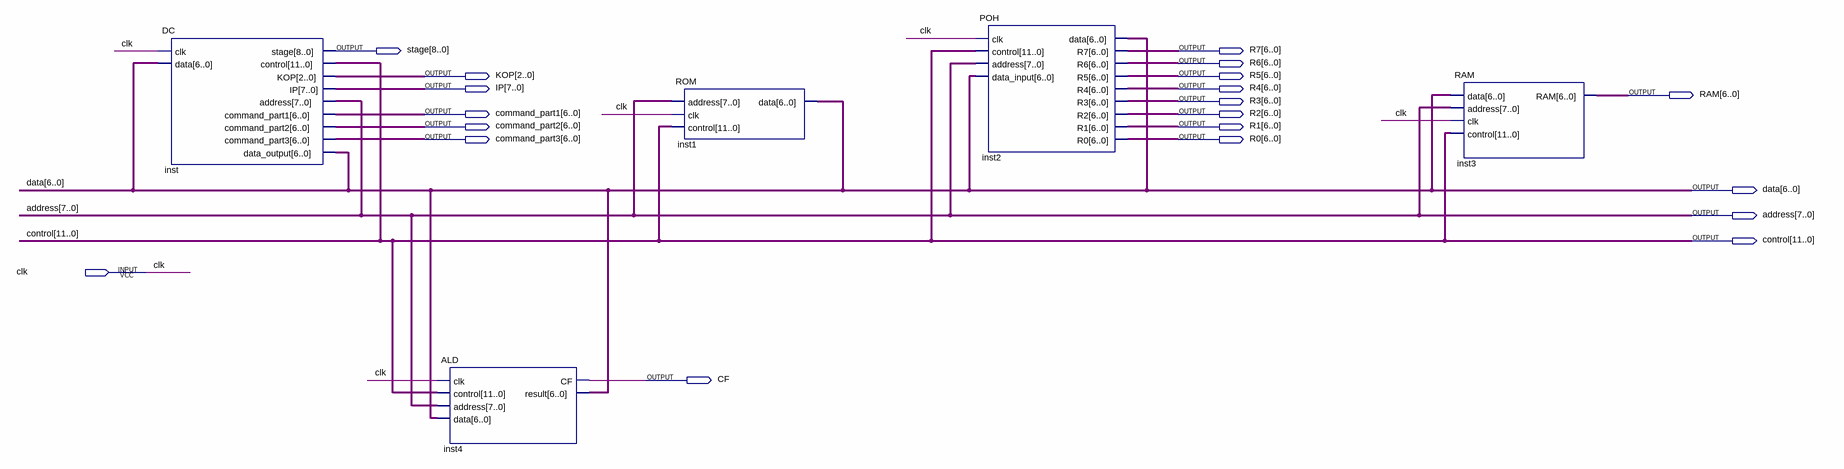
[diagram p0: schematic sheet]
// Quartus schematic main.bdf as structural Verilog: 5 symbols, 20 pins
module main (
  input  clk,
  output [8:0] stage,
  output [6:0] R7,
  output [6:0] R6,
  output [2:0] KOP,
  output [6:0] R5,
  output [7:0] IP,
  output [6:0] R4,
  output [6:0] RAM,
  output [6:0] R3,
  output [6:0] command_part1,
  output [6:0] R2,
  output [6:0] command_part2,
  output [6:0] R1,
  output [6:0] command_part3,
  output [6:0] R0,
  output [6:0] data,
  output [7:0] address,
  output [11:0] control,
  output CF
);

  DC inst (
    .clk(clk), .data(data), .stage(stage), .control(control), .KOP(KOP), .IP(IP), .address(address),
    .command_part1(command_part1), .command_part2(command_part2), .command_part3(command_part3),
    .data_output(data));
  ALD inst4 (.clk(clk), .control(control), .address(address), .data(data), .CF(CF), .result(data));
  ROM inst1 (.address(address), .clk(clk), .control(control), .data(data));
  POH inst2 (
    .clk(clk), .control(control), .address(address), .data_input(data), .data(data), .R7(R7), .R6(R6),
    .R5(R5), .R4(R4), .R3(R3), .R2(R2), .R1(R1), .R0(R0));
  RAM inst3 (.data(data), .address(address), .clk(clk), .control(control), .RAM(RAM));
endmodule
